# EAGLE design nibblet (EAGLE 6.4)
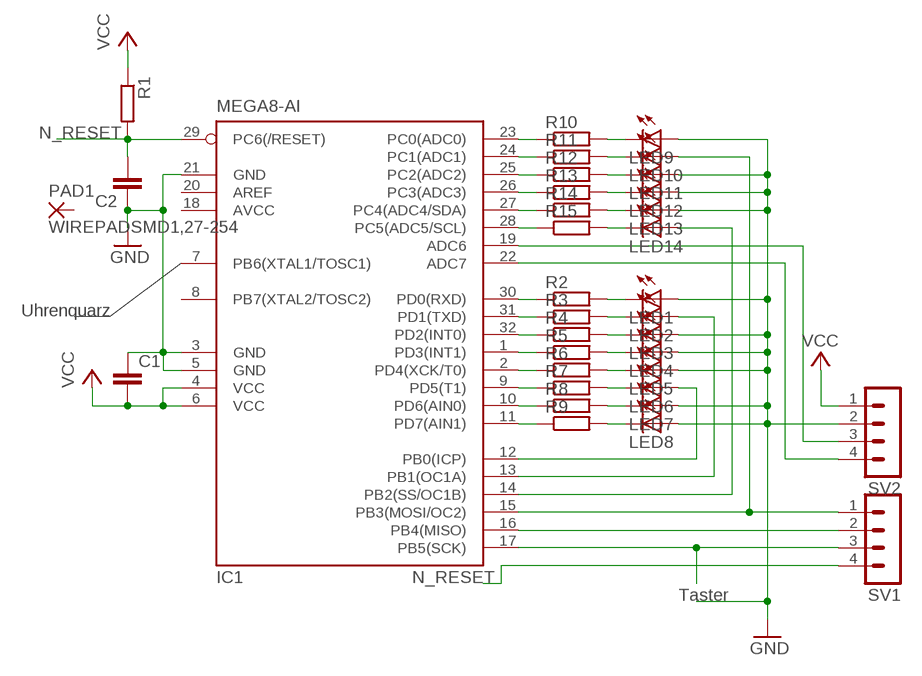
[diagram p0: schematic, sheet 1]

## Parts
C1  C-EUC1206  [C1206]
C2  C-EUC1206  [C1206]
IC1  MEGA8-AI  [TQFP32-08]
LED1  LEDCHIP-LED0805  [CHIP-LED0805]
LED2  LEDCHIP-LED0805  [CHIP-LED0805]
LED3  LEDCHIP-LED0805  [CHIP-LED0805]
LED4  LEDCHIP-LED0805  [CHIP-LED0805]
LED5  LEDCHIP-LED0805  [CHIP-LED0805]
LED6  LEDCHIP-LED0805  [CHIP-LED0805]
LED7  LEDCHIP-LED0805  [CHIP-LED0805]
LED8  LEDCHIP-LED0805  [CHIP-LED0805]
LED9  LEDCHIP-LED0805  [CHIP-LED0805]
LED10  LEDCHIP-LED0805  [CHIP-LED0805]
LED11  LEDCHIP-LED0805  [CHIP-LED0805]
LED12  LEDCHIP-LED0805  [CHIP-LED0805]
LED13  LEDCHIP-LED0805  [CHIP-LED0805]
LED14  LEDCHIP-LED0805  [CHIP-LED0805]
PAD1  WIREPADSMD1,27-254  [SMD1,27-2,54]
R1  R-EU_M1206  [M1206]
R2  R-EU_R0805  [R0805]
R3  R-EU_R0805  [R0805]
R4  R-EU_R0805  [R0805]
R5  R-EU_R0805  [R0805]
R6  R-EU_R0805  [R0805]
R7  R-EU_R0805  [R0805]
R8  R-EU_R0805  [R0805]
R9  R-EU_R0805  [R0805]
R10  R-EU_R0805  [R0805]
R11  R-EU_R0805  [R0805]
R12  R-EU_R0805  [R0805]
R13  R-EU_R0805  [R0805]
R14  R-EU_R0805  [R0805]
R15  R-EU_R0805  [R0805]
SV1  MA04-1  [MA04-1]
SV2  MA04-1  [MA04-1]

## Nets
GND: C1.1 C2.1 IC1.3(GND) IC1.5(GND) IC1.21(GND) LED1.A LED3.A LED4.A LED5.A LED7.A LED8.A LED9.A LED11.A LED12.A LED13.A SV2.2
N$1: IC1.25(PC2(ADC2)) R12.1
N$2: LED11.C R12.2
N$3: IC1.23(PC0(ADC0)) R10.1
N$4: IC1.24(PC1(ADC1)) R11.1
N$5: IC1.26(PC3(ADC3)) R13.1
N$6: LED12.C R13.2
N$7: IC1.27(PC4(ADC4/SDA)) R14.1
N$8: IC1.30(PD0(RXD)) R2.1
N$9: IC1.31(PD1(TXD)) R3.1
N$10: IC1.32(PD2(INT0)) R4.1
N$11: IC1.1(PD3(INT1)) R5.1
N$12: IC1.2(PD4(XCK/T0)) R6.1
N$13: IC1.9(PD5(T1)) R7.1
N$14: IC1.10(PD6(AIN0)) R8.1
N$15: IC1.15(PB3(MOSI/OC2)) LED10.A SV1.1
N$16: IC1.22(ADC7) SV2.4
N$17: IC1.11(PD7(AIN1)) R9.1
N$18: LED8.C R9.2
N$19: IC1.19(ADC6) SV2.3
N$20: IC1.14(PB2(SS/OC1B)) LED14.A
N$21: IC1.17(PB5(SCK)) SV1.3
N$22: IC1.13(PB1(OC1A)) LED2.A
N$23: IC1.12(PB0(ICP)) LED6.A
N$24: IC1.16(PB4(MISO)) SV1.2
N$25: LED7.C R8.2
N$26: LED6.C R7.2
N$27: LED5.C R6.2
N$28: LED4.C R5.2
N$29: LED3.C R4.2
N$30: LED2.C R3.2
N$31: LED1.C R2.2
N$32: LED13.C R14.2
N$33: IC1.28(PC5(ADC5/SCL)) R15.1
N$34: LED14.C R15.2
N$35: LED10.C R11.2
N$36: LED9.C R10.2
N_RESET: C2.2 IC1.29(PC6(/RESET)) R1.2 SV1.4
VCC: C1.2 IC1.4(VCC) IC1.6(VCC) R1.1 SV2.1
Unconnected: IC1.7(PB6(XTAL1/TOSC1)) IC1.8(PB7(XTAL2/TOSC2)) IC1.20(AREF) PAD1.1(P)

## Notes on the sheet
- Uhrenquarz
- Taster

## Power pins joined to a net without a drawn wire
AVCC: IC1.18(AVCC)

## Library data of the parts
C1 C2 = rcl:C-EU: CAPACITOR, European symbol
IC1 = atmel:MEGA8: MICROCONTROLLER 8 Kbytes FLASH, 1 kbytes SRAM, 512 bytes EEPROM, USART, 6-channel 10 bit ADC, 2-channel 8 bit ADC Pin compatible with Atmega48, ATMega88, ATMega168 Source: avr.lbr
LED1-LED14 = led:LED: LED OSRAM: - CHIPLED LG R971, LG N971, LY N971, LG Q971, LY Q971, LO R971, LY R971 LH N974, LH R974 LS Q976, LO Q976, LY Q976 LO Q996 - Hyper CHIPLED LW Q18S LB Q993, LB Q99A, LB R99A - SideLED LS A670, LO A670, LY A670, LG A670, LP A670 LB A673, LV A673, LT A673, LW A673 LH A674 LY A675 LS A676, LA A676, LO A676, LY A676, LW A676 LS A679, LY A679, LG A679 - Hyper Micro SIDELED® LS Y876, LA Y876, LO Y876, LY Y876 LT Y87S - SmartLED LW L88C, LW L88S LB L89C, LB L89S, LG L890 LS L89K, LO L89K, LY L89K LS L896, LA L896, LO L896, LY L896 - TOPLED LS T670, LO T670, LY T670, LG T670, LP T670 LSG T670, LSP T670, LSY T670, LOP T670, LYG T670 LG T671, LOG T671, LSG T671 LB T673, LV T673, LT T673, LW T673 LH T674 LS T676, LA T676, LO T676, LY T676, LB T676, LH T676, LSB T676, LW T676 LB T67C, LV T67C, LT T67C, LS T67K, LO T67K, LY T67K, LW E67C LS E67B, LA E67B, LO E67B, LY E67B, LB E67C, LV E67C, LT E67C LW T67C LS T679, LY T679, LG T679 LS T770, LO T770, LY T770, LG T770, LP T770 LB T773, LV T773, LT T773, LW T773 LH T774 LS E675, LA E675, LY E675, LS T675 LS T776, LA T776, LO T776, LY T776, LB T776 LHGB T686 LT T68C, LB T68C - Hyper Mini TOPLED® LB M676 - Mini TOPLED Santana® LG M470 LS M47K, LO M47K, LY M47K Source: http://www.osram.convergy.de LUXEON: - LUMILED® LXK2-PW12-R00, LXK2-PW12-S00, LXK2-PW14-U00, LXK2-PW14-V00 LXK2-PM12-R00, LXK2-PM12-S00, LXK2-PM14-U00 LXK2-PE12-Q00, LXK2-PE12-R00, LXK2-PE12-S00, LXK2-PE14-T00, LXK2-PE14-U00 LXK2-PB12-K00, LXK2-PB12-L00, LXK2-PB12-M00, LXK2-PB14-N00, LXK2-PB14-P00, LXK2-PB14-Q00 LXK2-PR12-L00, LXK2-PR12-M00, LXK2-PR14-Q00, LXK2-PR14-R00 LXK2-PD12-Q00, LXK2-PD12-R00, LXK2-PD12-S00 LXK2-PH12-R00, LXK2-PH12-S00 LXK2-PL12-P00, LXK2-PL12-Q00, LXK2-PL12-R00 Source: www.luxeon.com KINGBRIGHT: KA-3528ASYC Source: www.kingbright.com
PAD1 = wirepad:WIREPAD: Wire PAD connect wire on PCB
R1-R15 = rcl:R-EU_: RESISTOR, European symbol
SV1 SV2 = con-lstb:MA04-1: PIN HEADER

## Board
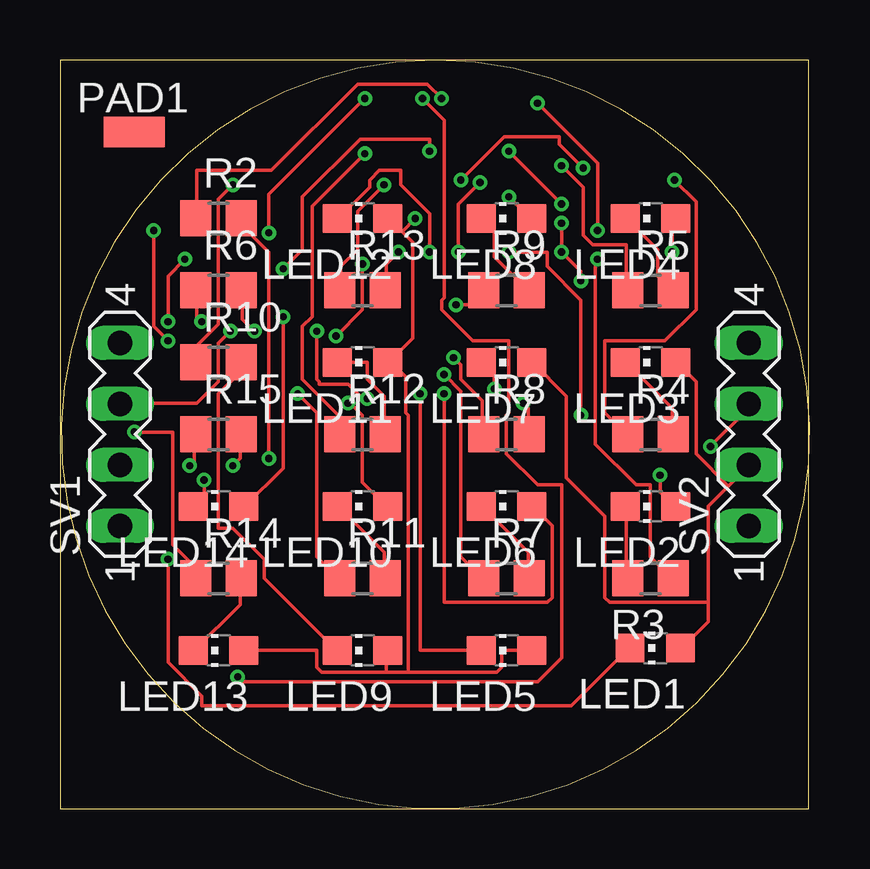
[diagram p1: board, top side]
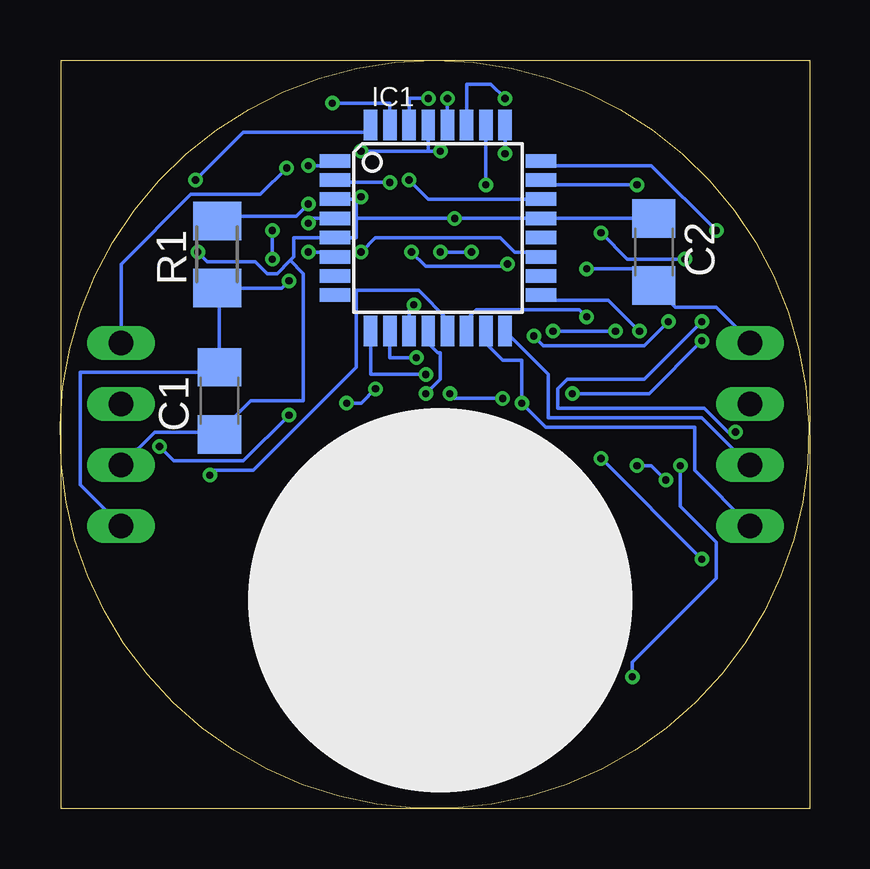
[diagram p2: board, bottom side, seen from below]

Size 31.25 x 31.2 mm. Coordinates in mm from the lower left corner, seen from the top.
Outline: 15.6,31.2 arc360 15.7,31.2 15.6,31.2
Outline: 0,0 31.2,0 31.2,31.2 0,31.2 0,0
Copper layers (1*16): Top 0.035mm / dielectric 1.5mm / Bottom 0.035mm
Design rules "leiton": minimum track width 6mil, minimum drill 0.3mm, track to track 6mil, track to pad 6mil, pad to pad 6mil, via to via 6mil, smd to smd 6mil, copper to edge 20mil, drill to drill 8mil, minimum pad ring 8mil, minimum via ring 6mil, stop-mask expansion 3mil, vias tented up to drill 0mil, thermal gap 8mil
bRestrict: area 7.1,0.4 to 23.7,17

### Footprints (pad centres in the part's own frame; a part is rotated, then mirrored left to right if it is on the bottom)
C1206 = smd 1.6 x 1.8: 1 -1.4,0; 2 1.4,0
TQFP32-08 = smd 1.27 x 0.559: 1 -4.293,2.8; 2 -4.293,2; 3 -4.293,1.2; 4 -4.293,0.4; 5 -4.293,-0.4; 6 -4.293,-1.2; 7 -4.293,-2; 8 -4.293,-2.8; 17 4.293,-2.8; 18 4.293,-2; 19 4.293,-1.2; 20 4.293,-0.4; 21 4.293,0.4; 22 4.293,1.2; 23 4.293,2; 24 4.293,2.8 | smd 0.559 x 1.27: 9 -2.8,-4.293; 10 -2,-4.293; 11 -1.2,-4.293; 12 -0.4,-4.293; 13 0.4,-4.293; 14 1.2,-4.293; 15 2,-4.293; 16 2.8,-4.293; 25 2.8,4.293; 26 2,4.293; 27 1.2,4.293; 28 0.4,4.293; 29 -0.4,4.293; 30 -1.2,4.293; 31 -2,4.293; 32 -2.8,4.293
CHIP-LED0805 = smd 1.2 x 1.2: A 0,-1.05; C 0,1.05
SMD1,27-2,54 = smd 1.27 x 2.54: 1 0,0
M1206 = smd 1.6 x 2: 1 -1.4,0; 2 1.4,0
R0805 = smd 1.3 x 1.5: 1 -0.95,0; 2 0.95,0
MA04-1 = drill 1.016 long: 1 -3.81,0; 2 -1.27,0; 3 1.27,0; 4 3.81,0

### Placement (x,y rotation side)
C1  24.6,17 90 bottom
C2  6.5,23.2 270 bottom
IC1  15.5,24.2 0 bottom
LED1  24.8,6.7 90 top
LED2  24.6,12.6 90 top
LED3  24.6,18.6 90 top
LED4  24.6,24.6 90 top
LED5  18.6,6.6 90 top
LED6  18.6,12.6 90 top
LED7  18.6,18.6 90 top
LED8  18.6,24.6 90 top
LED9  12.6,6.6 90 top
LED10  12.6,12.6 90 top
LED11  12.6,18.6 90 top
LED12  12.6,24.6 90 top
LED13  6.6,6.6 90 top
LED14  6.6,12.6 90 top
PAD1  3.1,28.2 270 top
R1  24.7,23.1 90 bottom
R2  6.6,24.6 0 top
R3  24.6,9.6 180 top
R4  24.6,15.6 0 top
R5  24.6,21.6 0 top
R6  6.6,21.6 0 top
R7  18.6,9.6 0 top
R8  18.6,15.6 0 top
R9  18.6,21.6 0 top
R10  6.6,18.6 0 top
R11  12.6,9.6 0 top
R12  12.6,15.6 0 top
R13  12.6,21.6 0 top
R14  6.6,9.6 0 top
R15  6.6,15.6 0 top
SV1  2.5,15.6 90 top
SV2  28.7,15.6 90 top

### Tracks (layer width: path | path; a pad name or v marks a point on that pad's centre or on a via)
GND  (via drill 0.3)
  Top 0.152: 14.25,24.05 13.7,24.6 LED12.A | 14.25,24.05 14.7,23.6 14.7,19.6 13.7,18.6 LED11.A 13.8,18.6 14.4,18 14.4,16.5 14.5,16.4 14.5,5.7 | LED13.A 10.7,6.6 10.7,5.9 10.9,5.7 13.6,5.7 | 13.6,5.7 13.6,6.6 LED9.A | LED5.A 18.4,6.6 18.4,5.9 18.2,5.7 14.5,5.7 | 13.6,5.7 14.5,5.7 | v18.7,25.5 19.6,24.6 LED8.A | v25.5,23.2 25.5,24.5 25.6,24.6 LED4.A | 27,8.6 27,12.6 27.85,13.45 | 27,8.6 27,7.8 25.9,6.7 LED1.A | 27.85,13.45 28.7,14.3 SV2.2 | 27,8.6 22.9,8.6 22.7,8.8 22.7,12.2 21.1,13.8 21.1,17.2 19.7,18.6 LED7.A | 27.85,13.45 26.5,14.8 26.5,17.8 25.7,18.6 LED3.A | v14.8,24.6 14.25,24.05
  Bottom 0.152: C2.1 IC1.21 v14.8,24.6 18.9,24.6 | IC1.3 18.9,25.4 | 18.9,25.4 18.8,25.4 v18.7,25.5 18.9,25.4 | v25.5,23.2 25.1,22.8 23.1,22.8 22.6,22.3 22.2,22.3 21.65,22.85 | 21.65,22.85 21.5,23 21.5,23.8 IC1.5 18.9,23.8 18.9,24.6 | 18.9,24.6 18.9,25.4 | SV2.2 28.7,14.4 28.6,14.4 27.3,15.7 24.7,15.7 C1.1 24.6,15.7 23.3,17 21.1,17 21.1,22.3 21.65,22.85
N$1  (via drill 0.3)
  Top 0.152: v12.7,27.3 10.5,25.1 10.5,20.5 10.1,20.1 10.1,17.9 11.6,16.4 11.6,15.6 R12.1
  Bottom 0.152: v12.7,27.3 IC1.25
N$2
  Top 0.152: LED11.C 12.8,18.6 12.8,17.9 13.5,17.2 13.5,15.6 R12.2
N$3  (via drill 0.3)
  Top 0.152: v7.2,26 6.6,25.4 6.6,20.2 5.7,19.3 5.7,18.6 R10.1
  Bottom 0.152: v7.2,26 11,26 IC1.23
N$4  (via drill 0.3)
  Top 0.152: v3.9,24.1 3.9,20.1 v4.5,19.5 | v9.9,17.3 10.7,16.5 10.7,10.5 11.6,9.6 R11.1
  Bottom 0.152: v3.9,24.1 6.6,26.8 11,26.8 IC1.24 | v4.5,19.5 6.7,17.3 v9.9,17.3
N$5  (via drill 0.3)
  Top 0.152: v13.5,26 12.4,24.9 12.4,23.3 11.7,22.6 11.7,21.6 R13.1
  Bottom 0.152: v13.5,26 IC1.26
N$6  (via drill 0.3)
  Top 0.152: v15.4,23.2 15.4,24.8 14.2,26 14.2,26.6 13.3,26.6 12.9,26.2 12.9,25.9 11.6,24.6 LED12.C | v14.1,23.2 13.6,22.7 13.6,21.6 R13.2
  Bottom 0.152: v14.1,23.2 v15.4,23.2
N$7  (via drill 0.3)
  Top 0.152: v12.7,29.6 8.7,25.6 v8.7,24 | v5.2,22.9 4.5,22.2 v4.5,20.3 | v3.1,15.7 4.7,15.7 4.7,11 5.6,10.1 5.6,9.6 R14.1
  Bottom 0.152: IC1.27 14.3,30.2 13.3,30.2 v12.7,29.6 | v8.7,24 7.6,22.9 v5.2,22.9 | v4.5,20.3 6.9,17.9 10.1,17.9 10.5,17.5 10.5,16.7 4.4,16.7 3.4,15.7 v3.1,15.7
N$8  (via drill 0.3)
  Top 0.152: v15.9,29.6 15.3,30.2 12.4,30.2 8.8,26.6 5.7,26.6 5.7,24.6 R2.1
  Bottom 0.152: IC1.30 16.7,29.6 v15.9,29.6
N$9  (via drill 0.3)
  Top 0.152: v19.9,29.4 22.4,26.9 v22.4,24.1 | v22.4,22.9 22.3,22.8 22.3,15.2 24,13.5 24.6,13.5 24.6,10.5 25.5,9.6 R3.1
  Bottom 0.152: IC1.31 17.5,29.4 v19.9,29.4 | v22.4,22.9 v22.4,24.1
N$10  (via drill 0.3)
  Top 0.152: v25.6,26.2 26.5,25.3 26.5,20.8 25.2,19.5 22.7,19.5 22.7,16.5 23.6,15.6 R4.1
  Bottom 0.152: v25.6,26.2 23.6,28.2 18.5,28.2 18.3,28.4 IC1.32
N$11  (via drill 0.3)
  Top 0.152: v20.9,26.8 21.8,25.9 21.8,23.9 22.2,23.5 23.6,23.5 23.6,21.6 R5.1
  Bottom 0.152: v20.9,26.8 20,26.8 IC1.1
N$12  (via drill 0.3)
  Top 0.152: v17.5,26.1 16.6,25.2 v16.6,23.2 | v12.6,22.7 12.6,20.8 v11.5,19.7 | v5.9,20.3 5.7,20.5 5.7,21.6 R6.1
  Bottom 0.152: v17.5,26.1 19.6,26.1 19.7,26.2 IC1.2 | v16.6,23.2 16,22.6 12.7,22.6 v12.6,22.7 | v11.5,19.7 11.1,19.3 6.9,19.3 v5.9,20.3
N$13  (via drill 0.3)
  Top 0.152: v16,18.1 16.7,17.4 16.7,10.5 17.6,9.6 R7.1
  Bottom 0.152: IC1.9 18.3,18.1 v16,18.1
N$14  (via drill 0.3)
  Top 0.152: v16.4,18.8 16.7,18.5 16.7,17.9 17.6,17 17.6,15.6 R8.1
  Bottom 0.152: IC1.10 17.5,18.8 v16.4,18.8
N$15  (via drill 0.3)
  Top 0.152: v12,16.9 12.1,16.9 12.6,16.4 12.6,13.6 13.6,12.6 LED10.A
  Bottom 0.152: IC1.15 13.5,19.4 12.8,18.7 12,18.7 v12,16.9 11,15.9 4.8,15.9 4.8,14.1 SV1.1
N$16  (via drill 0.3)
  Top 0.152: v16.7,26.2 18.5,28 20.8,28 20.8,27.7 v21.8,26.7
  Bottom 0.152: IC1.22 15.9,25.4 v16.7,26.2 | v21.8,26.7 22.9,25.6 25.8,25.6 28.7,22.7 SV2.4
N$17  (via drill 0.3)
  Top 0.152: v16.5,21 17.6,21 17.6,21.6 R9.1
  Bottom 0.152: IC1.11 16.7,21 v16.5,21
N$18
  Top 0.152: LED8.C 17.6,24.6 18.1,24.1 18.1,23 19.5,21.6 R9.2
N$19  (via drill 0.3)
  Top 0.152: v18.7,23.2 20.3,23.2 20.3,22.6 21.7,21.2 v21.7,16.4 | v27.1,15.1 28.7,16.7 SV2.3
  Bottom 0.152: v18.7,23.2 18.1,23.8 12.9,23.8 12.3,23.2 11.5,23.2 11.3,23 IC1.19 | v21.7,16.4 23.6,14.5 26.5,14.5 v27.1,15.1
N$20  (via drill 0.3)
  Top 0.152: v9.3,20.5 9.3,14.2 7.7,12.6 LED14.A
  Bottom 0.152: v9.3,20.5 9.6,20.8 13.9,20.8 14.3,20.4 IC1.14
N$21  (via drill 0.3)
  Top 0.152: v7.1,19.9 6.6,19.4 6.6,17.8 5.7,16.9 2.5,16.9 SV1.3
  Bottom 0.152: v7.1,19.9 8.4,21.2 11,21.2 IC1.17
N$22  (via drill 0.3)
  Top 0.152: v25,13.9 25,13.2 25.6,12.6 LED2.A
  Bottom 0.152: v25,13.9 24.8,14.1 23.2,14.1 18.9,18.4 18.9,21.6 16.3,21.6 15.1,20.4 IC1.13
N$23  (via drill 0.3)
  Top 0.152: v16,17.3 16,8.6 20.3,8.6 20.5,8.8 20.5,11.8 19.7,12.6 LED6.A
  Bottom 0.152: v16,17.3 15.4,17.9 15.4,19 15.5,19 15.9,19.4 IC1.12
N$24
  Bottom 0.152: IC1.16 10.9,18.1 10.9,16.3 4.5,16.3 2.6,14.4 2.5,14.4 SV1.2
N$25  (via drill 0.3)
  Top 0.152: v18.1,17.5 18.1,18.1 17.6,18.6 LED7.C | v19.3,16.9 19.5,16.7 19.5,15.6 R8.2
  Bottom 0.152: v18.1,17.5 18.7,16.9 v19.3,16.9
N$26
  Top 0.152: LED6.C 17.6,12.6 19.5,10.7 19.5,9.6 R7.2
N$27  (via drill 0.3)
  Top 0.152: LED5.C 15,6.6 v15,17.3 | v12.8,17.1 12.6,17.1 12,17.7 10.8,17.7 10.8,17.8 10.7,17.9 v10.7,19.9 | v8.1,19.9 7.6,20.4 7.6,21.6 R6.2
  Bottom 0.152: v15,17.3 14.8,17.1 v12.8,17.1 | v8.1,19.9 v10.7,19.9
N$28
  Top 0.152: LED4.C 23.6,24.6 24.9,23.3 24.9,22.2 25.5,21.6 R5.2
N$29
  Top 0.152: LED3.C 23.6,18.6 25.5,16.7 25.5,15.6 R4.2
N$30
  Top 0.152: LED2.C 23.6,12.6 23.6,9.6 R3.2
N$31  (via drill 0.3)
  Top 0.152: v4.5,10.4 4.5,6.1 5.9,4.7 5.9,4.3 21.3,4.3 23.7,6.7 LED1.C | v8.7,14.6 8.7,23.2 7.6,24.3 7.6,24.6 R2.2
  Bottom 0.152: v8.7,14.6 v4.5,10.4
N$32
  Top 0.152: LED13.C 5.6,6.6 7.5,8.5 7.5,9.6 R14.2
N$33  (via drill 0.3)
  Top 0.152: v15.1,29.6 16,28.7 16,21.3 15.9,21.2 15.9,20.8 17.2,19.5 18.7,19.5 18.7,16.5 18.6,16.4 18.6,14.8 19.9,13.5 20.9,13.5 20.9,6.3 19.9,5.3 7.4,5.3 v7.4,5.5 | v5.4,14.3 5.6,14.5 5.6,15.6 R15.1
  Bottom 0.152: v15.1,29.6 IC1.28 | v7.4,5.5 7.4,6.1 3.9,9.6 3.9,11.1 5.4,12.6 v5.4,14.3
N$34  (via drill 0.3)
  Top 0.152: v6,13.7 6,13 5.6,12.6 LED14.C | v7.2,14.3 7.5,14.6 7.5,15.6 R15.2
  Bottom 0.152: v6,13.7 6.6,14.3 v7.2,14.3
N$35
  Top 0.152: LED10.C 11.6,12.6 13.5,10.7 13.5,9.6 R11.2
N$36
  Top 0.152: LED9.C 11.5,6.6 8.5,9.6 8.5,10.4 7.2,11.7 6.6,11.7 6.6,17.3 7.5,18.2 7.5,18.6 R10.2
N_RESET  (via drill 0.3)
  Top 0.152: v20.9,25.2 v18.7,27.4 | v9.3,22.5 10.1,23.3 10.1,25.5 12.5,27.9 15.4,27.9 v15.4,27.4
  Bottom 0.152: SV1.4 2.5,19.5 3.9,20.9 5.6,20.9 C2.2 7.2,22.5 v9.3,22.5 | 15.9,27.4 IC1.29 | v18.7,27.4 15.9,27.4 | v20.9,25.2 21.4,24.7 24.5,24.7 R1.2 | 15.9,27.4 v15.4,27.4
VCC  (via drill 0.3)
  Top 0.152: v20.9,24.4 v20.9,23.2 21.7,22.4 v21.7,22
  Bottom 0.152: v20.9,23.2 20,23.2 IC1.6 | v20.9,24.4 20.7,24.6 IC1.4 | 24.6,21.7 C1.2 24.8,18.2 30.4,18.2 30.4,13.5 SV2.1 | v21.7,22 22,21.7 24.6,21.7 | 24.6,21.7 R1.1